# Altium schematic sheet [3] Relays_Control.SchDoc
size A4; DocumentNumber: 5; SheetNumber: 6; SheetTotal: 10
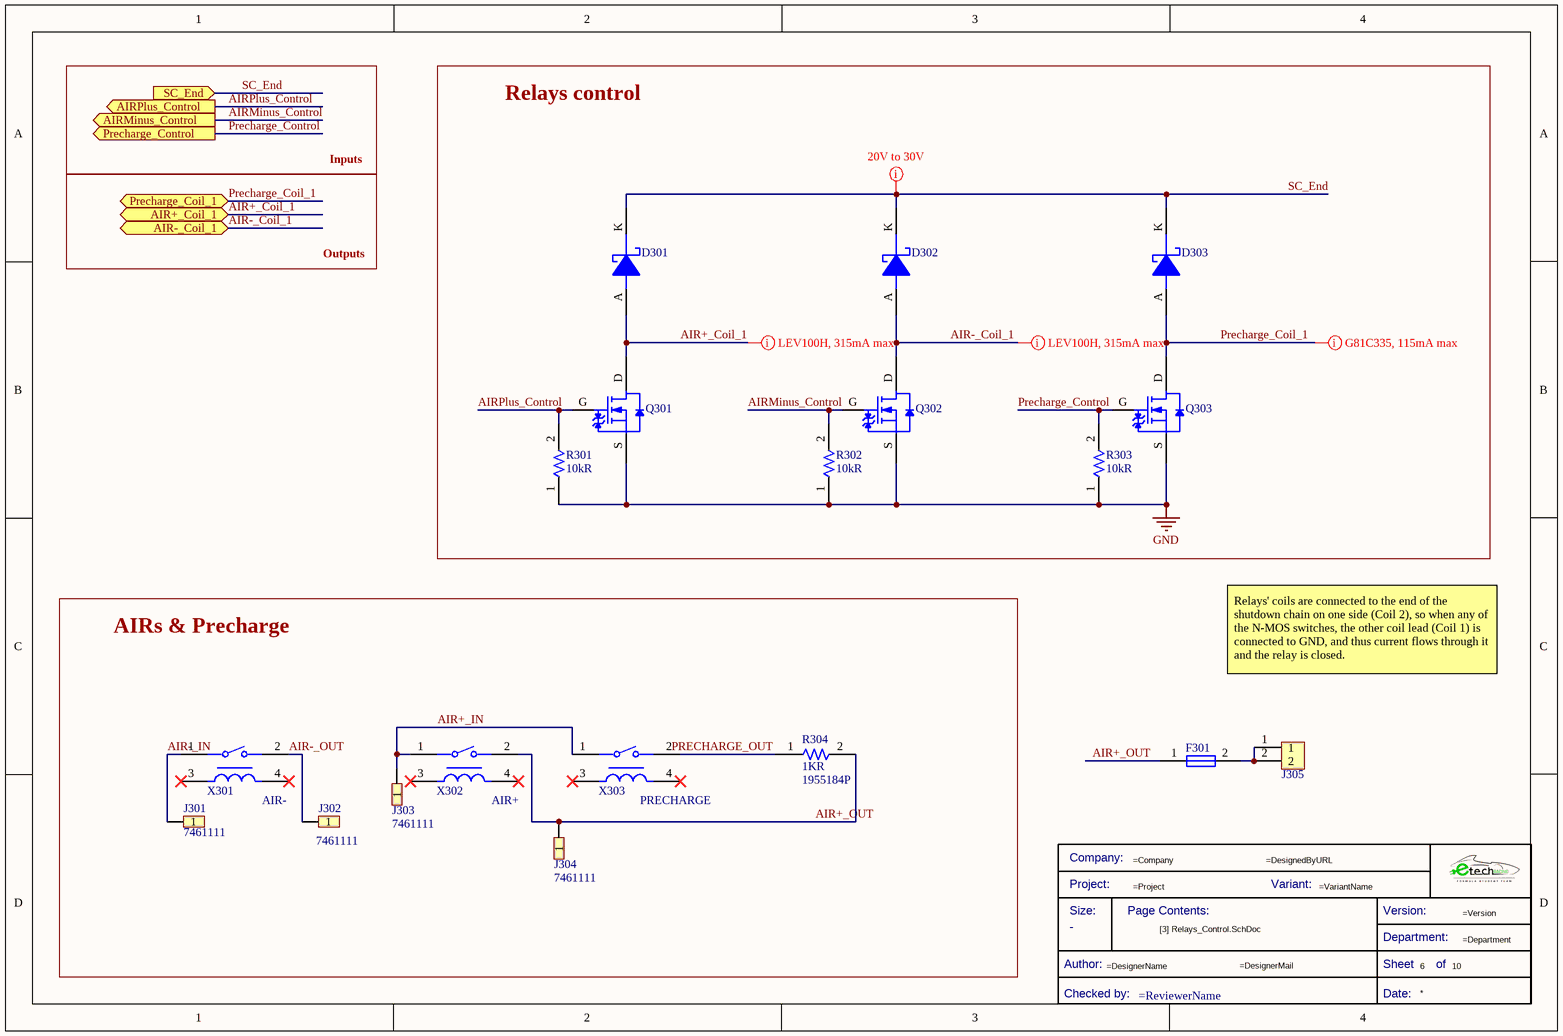
[diagram p0: [3] Relays_Control.SchDoc]

## Parts
*?  Title Block_template  (value not drawn)  (graphical)
D301  MBR0530  [DSC-SOD123]  (value not drawn)
D302  MBR0530  [DSC-SOD123]  (value not drawn)
D303  MBR0530  [DSC-SOD123]  (value not drawn)
F301  FUSE_2.5A_1000V  [FUSE_2.5A_1000V]  (value not drawn)
J301  7461111  [J_Power_Connector_180A]
J302  7461111  [J_Power_Connector_180A]
J303  7461111  [J_Power_Connector_180A]
J304  7461111  [J_Power_Connector_180A]
J305  436500215  [J_MicroFit_2x1]  (value not drawn)
Q301  CPH3455-TL-H  [TRT-NCH-3/35-CPH]  (value not drawn)
Q302  CPH3455-TL-H  [TRT-NCH-3/35-CPH]  (value not drawn)
Q303  CPH3455-TL-H  [TRT-NCH-3/35-CPH]  (value not drawn)
R301  Resistance: 10kR  [R0805FTK]  (hidden comment: CR0805-JW-103ELF)
R302  Resistance: 10kR  [R0805FTK]  (hidden comment: CR0805-JW-103ELF)
R303  Resistance: 10kR  [R0805FTK]  (hidden comment: CR0805-JW-103ELF)
R304  Resistance: 1KR  Supplier Part Number 1: 1955184P  [RTO247]  (hidden comment: R470-TO247)
X301  AIR-  [RELAY_LEV100H]
X302  AIR+  [RELAY_LEV100H]
X303  PRECHARGE  [RELAY_LEV100H]

## Blocks framed on the sheet
Relays control: D301-D303 Q301-Q303 R301-R303
AIRs & Precharge: J301-J304 R304 X301-X303

## Ports
AIR+_Coil_1 (bidir), AIR-_Coil_1 (bidir), AIRMinus_Control (out), AIRPlus_Control (out), Precharge_Coil_1 (bidir), Precharge_Control (out), SC_End (in)

## Nets
GND: Q301.S Q302.S Q303.S R301.1 R302.1 R303.1
AIR+_Coil_1: D301.A Q301.D ; port AIR+_Coil_1
AIR+_IN: J303.1 X302.1 X303.1
AIR+_OUT: F301.1 J304.1 R304.2 X302.2
AIR-_Coil_1: D302.A Q302.D ; port AIR-_Coil_1
AIR-_IN: J301.1 X301.1
AIR-_OUT: J302.1 X301.2
AIRMinus_Control: Q302.G R302.2 ; port AIRMinus_Control
AIRPlus_Control: Q301.G R301.2 ; port AIRPlus_Control
Precharge_Coil_1: D303.A Q303.D ; port Precharge_Coil_1
Precharge_Control: Q303.G R303.2 ; port Precharge_Control
PRECHARGE_OUT: R304.1 X303.2
SC_End: D301.K D302.K D303.K ; port SC_End
NetF301_2: F301.2 J305.1 J305.2

Not connected (* = marked no-connect by the designer): X301 3* 4*; X302 3* 4*; X303 3* 4*

## Layout directives
mark named 20V to 30V: SC_End
mark named LEV100H, 315mA max: AIR+_Coil_1, AIR-_Coil_1
mark named G81C335, 115mA max: Precharge_Coil_1

## Notes on the sheet
- Inputs
- Outputs
- Relays' coils are connected to the end of the shutdown chain on one side (Coil 2), so when any of the N-MOS switches, the other coil lead (Coil 1) is connected to GND, and thus current flows through it and the relay is closed.
- (in symbol Title Block_template) Company:; Project:; Variant:; Size:; Page Contents:; Version:; Department:; Author:; Sheet; of; Checked by:; Date:

## Library data of the parts
*? = Title Block_template: Standard Title Block; Category: Title Block; Checked by:: =ReviewerName; Size: -
D301-D303 = DSC-0.5/30-SOD123: VR=30V IF=500mA 30pF P=410mW; Element Configuration: Single; Forward Voltage: 430mV; Peak Non-Repetitive Surge Current: 5.5A; Average Rectified Current: 500mA; Max Reverse Leakage Current: 130uA; Max Reverse Voltage (DC): 30V; Polarity: Standard; .Creator: GP; Category: Diode; ComponentLink1Description: Datasheet; ComponentLink1URL: *; ComponentLink2Description: Where buy it; ComponentLink2URL: *; Supplier 1: Newark; Stock 1: 9; Pricing 1: 1=0,34400, 10=0,23900, 100=0,12200, 500=0,10000 (USD); Mount: Surface Mount; Contact Plating: Tin,Matte; Weight: 0.03g; Package Quantity: 1; Max Surge Current: 5.5A; Forward Current: 500mA; Max Reverse Current: 130uA; Max Repetitive Reverse Voltage (Vrrm): 30V; Max Forward Surge Current (Ifsm): 5.5A; Voltage Rating (DC): 30V; Current Rating: 500mA; Output Current: 500mA; Series: -; Length: 2.7mm; Width: 1.6mm; Height: 1.03mm; Radiation Hardening: No; RoHS Compliant: Yes; REACH SVHC: No SVHC; Lead Free: Lead Free; ComponentLink3URL: https://datasheet.ciiva.com/30479/0900766b810e2512-30479401.pdf?src-supplier=RSComponents; ComponentLink3Description: https://datasheet.ciiva.com/30479/0900766b810e2512-30479401.pdf?src-supplier=RSComponents; ComponentLink4URL: https://datasheet.ciiva.com/34301/974753-34301826.pdf?src-supplier=Jameco; ComponentLink4Description: https://datasheet.ciiva.com/34301/974753-34301826.pdf?src-supplier=Jameco; ComponentLink5URL: https://datasheet.ciiva.com/910/mbr0530-910516.pdf?src-supplier=Digi-Key; ComponentLink5Description: https://datasheet.ciiva.com/910/mbr0530-910516.pdf?src-supplier=Digi-Key; ComponentLink6URL: https://datasheet.ciiva.com/25931/mbr0530-25931989.pdf?src-supplier=Avnet+Europe; ComponentLink6Description: https://datasheet.ciiva.com/25931/mbr0530-25931989.pdf?src-supplier=Avnet+Europe; ComponentLink7URL: https://datasheet.ciiva.com/8300/mbr0530-8300905.pdf?src-supplier=Avnet; ComponentLink7Description: https://datasheet.ciiva.com/8300/mbr0530-8300905.pdf?src-supplier=Avnet; ComponentLink8URL: https://datasheet.ciiva.com/17318/mbr0530-17318568.pdf?src-supplier=Future+Electronics; ComponentLink8Description: https://datasheet.ciiva.com/17318/mbr0530-17318568.pdf?src-supplier=Future+Electronics; ComponentLink9URL: https://datasheet.ciiva.com/15144/getdatasheetpartid-86760-15144598.pdf?src-supplier=Verical; ComponentLink9Description: https://datasheet.ciiva.com/15144/getdatasheetpartid-86760-15144598.pdf?src-supplier=Verical; ComponentLink10URL: https://datasheet.ciiva.com/910/mbr0530-910518.pdf?src-supplier=Digi-Key; ComponentLink10Description: https://datasheet.ciiva.com/910/mbr0530-910518.pdf?src-supplier=Digi-Key; Supplier Part Number 1: 15R3453
J301-J304 = J_Power_Connector_180A
J305 = J_MicroFit_2x1: Header 1 Row Vertical Polarizing Peg 2 Pin SMT/Glow Wire Compatible Tin Plate; Manufacturer 1: Molex; Manufacturer Part Number 1: 43650-0215; Supplier 1: Arrow Electronics; RoHS: Yes; Category: Headers and Wire Housings; Stock 1: 11086; Pricing 1: 1=0,87800, 10=0,74400, 80=0,63070, 3264=0,47000, 6528=0,45100, 13056=0,41760 (USD); ComponentLink1URL: https://datasheet.ciiva.com/19462/884109-19462034.pdf?src-supplier=Jameco; ComponentLink1Description: https://datasheet.ciiva.com/19462/884109-19462034.pdf?src-supplier=Jameco; ComponentLink2URL: https://datasheet.ciiva.com/5157/0436500215-pcb-headers-148687-5157608.pdf?src-supplier=Mouser; ComponentLink2Description: https://datasheet.ciiva.com/5157/0436500215-pcb-headers-148687-5157608.pdf?src-supplier=Mouser; ComponentLink3URL: https://datasheet.ciiva.com/16085/0436500215-pcb-headers-16085668.pdf?src-supplier=Onlinecomponents.com; ComponentLink3Description: https://datasheet.ciiva.com/16085/0436500215-pcb-headers-16085668.pdf?src-supplier=Onlinecomponents.com; ComponentLink4URL: https://datasheet.ciiva.com/11748/0900766b80307ce2-11748388.pdf?src-supplier=RSComponents; ComponentLink4Description: https://datasheet.ciiva.com/11748/0900766b80307ce2-11748388.pdf?src-supplier=RSComponents; ComponentLink5URL: https://datasheet.ciiva.com/9432/0436500215-pcb-headers-9432850.pdf?src-supplier=Avnet; ComponentLink5Description: https://datasheet.ciiva.com/9432/0436500215-pcb-headers-9432850.pdf?src-supplier=Avnet; ComponentLink6URL: https://datasheet.ciiva.com/7920/1889390-7920892.pdf?src-supplier=Element14; ComponentLink6Description: https://datasheet.ciiva.com/7920/1889390-7920892.pdf?src-supplier=Element14; Supplier Part Number 1: 43650-0215
Q301-Q303 = TRT-NCH-3/35-CPH: CPH3455-TL-H N-channel MOSFET Transistor; 3 A; 35 V; 3-Pin CPH; Manufacturer: ON Semiconductor; Rds On Max: 104mR; Input Capacitance: 186pF; Rise Time: 4.7ns; Drain to Source Voltage (Vdss): 35V; Continuous Drain Current (ID): 3A; Max Power Dissipation: 1W; Drain to Source Resistance: 108mR; Turn-On Delay Time: 4.2ns; Turn-Off Delay Time: 15ns; Fall Time: 5.7ns; Element Configuration: Single; Gate to Source Voltage (Vgs): 20V; .Creator: GP; Category: Transistor; ComponentLink1Description: Datasheet; ComponentLink1URL: https://docs.rs-online.com/5847/0900766b812d514d.pdf; ComponentLink2Description: Where buy it; ComponentLink2URL: https://es.rs-online.com/web/p/mosfet/8009989; Supplier 1: RSComponents; Manufacturer Part Number: CPH3455-TL-H; RoHS: Yes; Stock 1: 1; Pricing 1: 50=0,50400 (USD); Case/Package: SC; Number of Pins: 3; Min Operating Temperature: -55°C; Max Operating Temperature: 150°C; Package Quantity: 3000; Packaging: Tape and Reel; Drain to Source Breakdown Voltage: 35V; Power Dissipation: 1W; Polarity: N-CHANNEL; Series: -; Length: 2.9mm; Width: 1.6mm; Height: 0.9mm; Lead Free: Lead Free; Halogen Free: Halogen Free; RoHS Compliant: Yes; ComponentLink3URL: https://datasheet.ciiva.com/947/cph3455-d-947201.pdf?src-supplier=Digi-Key; ComponentLink3Description: https://datasheet.ciiva.com/947/cph3455-d-947201.pdf?src-supplier=Digi-Key; ComponentLink4URL: https://datasheet.ciiva.com/4444/cph3455-d-91653-4444616.pdf?src-supplier=Mouser; ComponentLink4Description: https://datasheet.ciiva.com/4444/cph3455-d-91653-4444616.pdf?src-supplier=Mouser; ComponentLink5URL: https://datasheet.ciiva.com/11164/cph3455-d-11164889.pdf?src-supplier=Avnet; ComponentLink5Description: https://datasheet.ciiva.com/11164/cph3455-d-11164889.pdf?src-supplier=Avnet; Supplier Part Number 1: 8009989
R301-R303 = R10k-0805FTK: BOURNS         CR0805-JW-103ELF            Surface Mount Chip Resistor, Thick Film, CR Series, 10 kohm, 125 mW,  5%, 150 V; Temperature Coefficient: 200ppm/°C; Power Rating: 125mW; Voltage Rating: 150V; Voltage Rating (DC): 100V; .Creator: DR; Supplier 1: Arrow Electronics; Manufacturer 1: Bourns; Manufacturer Part Number 1: CR0805-JW-103ELF; RoHS: Yes; Category: Chip SMD Resistors; Stock 1: 57566; Pricing 1: 1=0,05790, 10=0,01540, 25=0,01340, 100=0,00340 (USD); Mount: Surface Mount; Case/Package: 0805; Number of Pins: 2; Contact Plating: Tin; Case Code (Metric): 2012; Case Code (Imperial): 0805; Min Operating Temperature: -55°C; Max Operating Temperature: 155°C; Tolerance: 5%; Resistor Type: Thick Film; Package Quantity: 1; Packaging: Tape and Reel; Number of Terminations: 2; Termination: SMD/SMT; Max Power Dissipation: 125mW; Features: Moisture Resistant; Series: CR0805; Construction: Rectangular; Resistance Tolerance: 5%; Technology: THICK FILM; Length: 2mm; Width: 1.25mm; Height: 0.5mm; Depth: 1.25mm; Thickness: 508um; Radiation Hardening: No; REACH SVHC: No SVHC; Military Standard: Not; RoHS Compliant: Yes; ComponentLink1URL: https://datasheet.ciiva.com/11821/0900766b80fcdb72-11821135.pdf?src-supplier=RSComponents; ComponentLink1Description: https://datasheet.ciiva.com/11821/0900766b80fcdb72-11821135.pdf?src-supplier=RSComponents; ComponentLink2URL: https://datasheet.ciiva.com/9122/chpreztr-9122374.pdf?src-supplier=Avnet; ComponentLink2Description: https://datasheet.ciiva.com/9122/chpreztr-9122374.pdf?src-supplier=Avnet; ComponentLink3URL: https://datasheet.ciiva.com/22693/1902866-22693254.pdf?src-supplier=Element14; ComponentLink3Description: https://datasheet.ciiva.com/22693/1902866-22693254.pdf?src-supplier=Element14; ComponentLink4URL: https://datasheet.ciiva.com/7986/691949-7986187.pdf?src-supplier=Element14; ComponentLink4Description: https://datasheet.ciiva.com/7986/691949-7986187.pdf?src-supplier=Element14; ComponentLink5URL: https://datasheet.ciiva.com/30065/159chpreztr-30065976.pdf?src-supplier=Onlinecomponents.com; ComponentLink5Description: https://datasheet.ciiva.com/30065/159chpreztr-30065976.pdf?src-supplier=Onlinecomponents.com; ComponentLink6URL: https://datasheet.ciiva.com/16783/70154685-16783482.pdf?src-supplier=Allied+Electronics; ComponentLink6Description: https://datasheet.ciiva.com/16783/70154685-16783482.pdf?src-supplier=Allied+Electronics; ComponentLink7URL: https://datasheet.ciiva.com/5548/chpreztr-5548491.pdf?src-supplier=Mouser; ComponentLink7Description: https://datasheet.ciiva.com/5548/chpreztr-5548491.pdf?src-supplier=Mouser; ComponentLink8URL: https://datasheet.ciiva.com/6559/chpreztr-6559900.pdf?src-supplier=Digi-Key; ComponentLink8Description: https://datasheet.ciiva.com/6559/chpreztr-6559900.pdf?src-supplier=Digi-Key; ComponentLink9URL: https://datasheet.ciiva.com/6559/chpreztr-6559901.pdf?src-supplier=Digi-Key; ComponentLink9Description: https://datasheet.ciiva.com/6559/chpreztr-6559901.pdf?src-supplier=Digi-Key; ComponentLink10URL: https://datasheet.ciiva.com/7985/1856384-7985869.pdf?src-supplier=Element14; ComponentLink10Description: https://datasheet.ciiva.com/7985/1856384-7985869.pdf?src-supplier=Element14; ComponentLink11URL: https://datasheet.ciiva.com/48692/001055517-da-01-en-smd-wid-cr0805-jw-103elf-10k-ohm-1-8w-48692118.pdf?src-supplier=Conrad; ComponentLink11Description: https://datasheet.ciiva.com/48692/001055517-da-01-en-smd-wid-cr0805-jw-103elf-10k-ohm-1-8w-48692118.pdf?src-supplier=Conrad; Supplier Part Number 1: CR0805-JW-103ELF
R304 = R1K-TO247: Res, 1K, 100W, To-247, Thick Film Rohs Compliant: Yes |Cgs Te Connectivity MPT100C1K0F; Manufacturer Part Number: MPT100C470RF; Operating Supply Voltage: 700V; Value: 1kR; Manufacturer: TE Connectivity; RoHS: No; Stock 1: 67; Pricing 1: 1=16,67000, 5=15,51000, 10=14,17000, 25=12,67000, 50=11,50000 (GBP); ComponentLink1Description: Buy; ComponentLink1URL: https://es.rs-online.com/web/p/resistencias-de-montaje-en-orificio-pasante/1955176; ComponentLink2Description: Datasheet; ComponentLink2URL: https://docs.rs-online.com/e31c/A700000006565355.pdf; Category: Through-Hole Resistors; Stock 2: 28; Pricing 2: 5=23,84, 10=21,8, 25=19,49, 50=17,69 (EUR); Power Rating: 100W; ComponentLink3URL: https://datasheet.octopart.com/MPT100C1K0F-TE-Connectivity-datasheet-136791881.pdf?src-supplier=TE+Connectivity; ComponentLink3Description: https://datasheet.octopart.com/MPT100C1K0F-TE-Connectivity-datasheet-136791881.pdf?src-supplier=TE+Connectivity; Supplier 1: Rs
X301-X303 = Relay_LEV100H: Electromechanical Relay 12VDC 26Ohm 100A SPST-NO-DM(57.96x40.77)mm Chassis Contactor Relay; Manufacturer: Cynergy3; Manufacturer Part Number: DAR72410FU; Coil Current: 30.7mA; Throw Configuration: SPST; Operate Time: 3ms; Release Time: 2ms; Coil Resistance: 780R; Relay Type: Reed; Coil Type: Non-Latching; Coil Voltage (DC): 24V; Contact Current Rating: 3A; Supplier 1: Newark; RoHS: No; Category: Power Relays; Mount: Through Hole; Min Operating Temperature: -20°C; Max Operating Temperature: 70°C; Packaging: Bulk; Termination: Wire Leads; REACH SVHC: No SVHC; RoHS Compliant: No; ComponentLink1URL: http://www.cynergy3.com/sites/default/files/DA%28UL%29%20series%202016.pdf?src-supplier=Digi-Key; ComponentLink1Description: http://www.cynergy3.com/sites/default/files/DA%28UL%29%20series%202016.pdf?src-supplier=Digi-Key; ComponentLink2URL: http://www.farnell.com/datasheets/2145120.pdf?src-supplier=Element14; ComponentLink2Description: http://www.farnell.com/datasheets/2145120.pdf?src-supplier=Element14; Supplier Part Number 1: 98Y7538; Supplier 2: Digi-Key; Stock 2: 114; Pricing 2: 1=160,97, 10=151,5, 25=142,0312, 50=132,5624 (USD); ComponentLink3URL: https://datasheet.ciiva.com/2407/eng-ds-6-1773450-9-lev100-0908-2407297.pdf?src-supplier=Digi-Key; ComponentLink3Description: https://datasheet.ciiva.com/2407/eng-ds-6-1773450-9-lev100-0908-2407297.pdf?src-supplier=Digi-Key; ComponentLink4URL: https://datasheet.ciiva.com/31835/prt4038-31835873.pdf?src-supplier=Onlinecomponents.com; ComponentLink4Description: https://datasheet.ciiva.com/31835/prt4038-31835873.pdf?src-supplier=Onlinecomponents.com; Supplier Part Number 2: A101167-ND